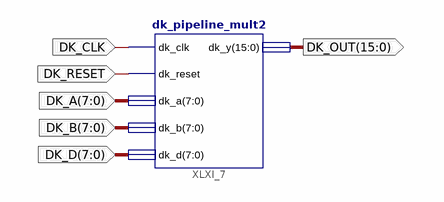
[diagram p0: schematic sheet 1]
// Xilinx ISE schematic test.sch (virtex7) as structural Verilog: 1 symbols, 6 ports
module test (
  input  DK_CLK,
  input  DK_RESET,
  input  [7:0] DK_A,
  input  [7:0] DK_B,
  input  [7:0] DK_D,
  output [15:0] DK_OUT
);

  dk_pipeline_mult2 XLXI_7 (.dk_clk(DK_CLK), .dk_reset(DK_RESET), .dk_a(DK_A), .dk_b(DK_B), .dk_d(DK_D), .dk_y(DK_OUT));
endmodule
